# Altium schematic sheet fat41p.SchDoc
size A4
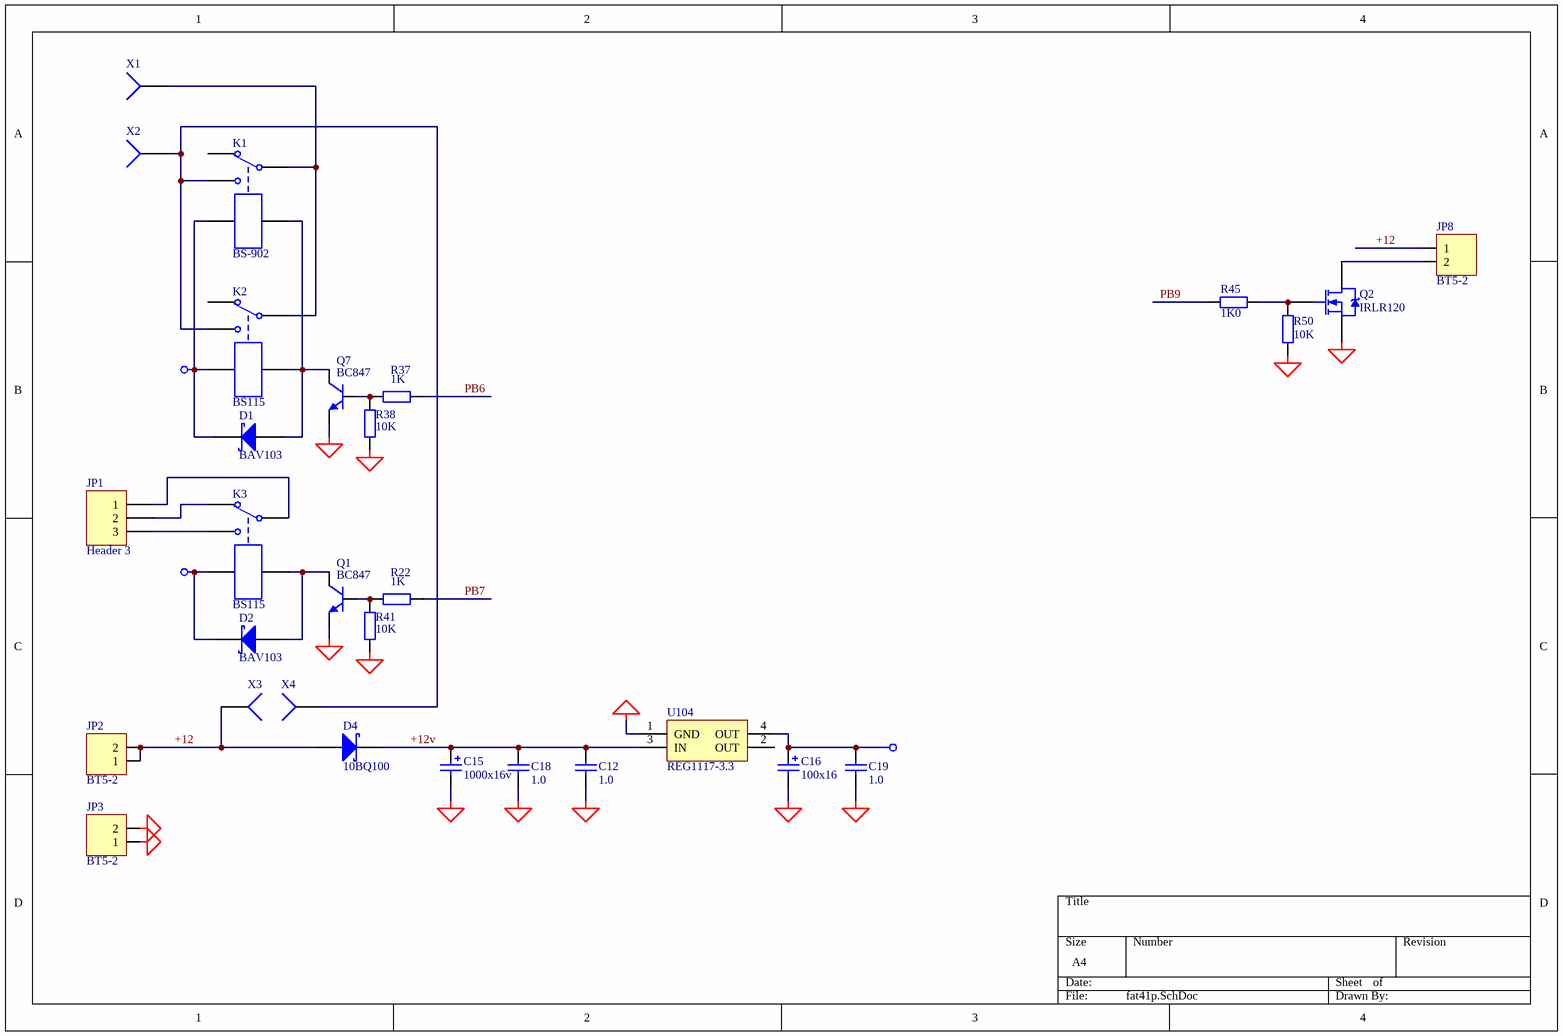
[diagram p0: fat41p.SchDoc]

## Parts
C12  value 1.0  [_1206]  (hidden comment: Cap)
C15  value 1000x16v  [el5]
C16  value 100x16  [el3]
C18  value 1.0  [_1206]  (hidden comment: Cap)
C19  value 1.0  [_1206]  (hidden comment: Cap)
D1  BAV103  [_1206d]
D2  BAV103  [_1206d]
D4  10BQ100  [DSO-C2/X2.3]
JP1  Header 3  [BT5-3]
JP2  BT5-2  [BT5-2-1]
JP3  BT5-2  [BT5-2-1]
JP8  BT5-2  [BT5-2-1]
K1  BS-902  [BS-902]
K2  BS115  [BS115]
K3  BS115  [BS115]
Q1  BC847  [SO-G3]
Q2  IRLR120  [SIP-G3/E8]
Q7  BC847  [SO-G3]
R22  value 1K  [_1206]  (hidden comment: Res2)
R37  value 1K  [_1206]  (hidden comment: Res2)
R38  value 10K  [_1206]  (hidden comment: Res2)
R41  value 10K  [_1206]  (hidden comment: Res2)
R45  1K0  [_1206]
R50  10K  [_1206]
U104  REG1117-3.3  [SIP-G3/C7.4]
X1  (no value)  [PIN3]
X2  (no value)  [PIN3]
X3  (no value)  [PIN1]
X4  (no value)  [PIN1]

## Nets
+3v3: C16.1 C19.2 U104.4(OUT)
+12v: C12.2 C15.1 C18.2 D1.2(K) D2.2(K) D4.2(K) K1.5 K2.5 K3.5 U104.3(IN)
GND: C12.1 C15.2 C16.2 C18.1 C19.1 JP3.1 JP3.2 Q1.2(E) Q2.3(S) Q7.2(E) R38.2 R41.2 R50.2 U104.1(GND)
+12: D4.1(A) JP2.1 JP2.2 JP8.1 X3.1
PB6: R37.2
PB7: R22.2
PB9: R45.1
NetD1_1: D1.1(A) K1.4 K2.4 Q7.3(C)
NetD2_1: D2.1(A) K3.4 Q1.3(C)
NetJP1_1: JP1.1 K3.1
NetJP1_2: JP1.2 K3.2
NetJP1_3: JP1.3 K3.3
NetJP8_2: JP8.2 Q2.4(D)
NetK1_1: K1.1 K2.1 X1.1
NetK1_3: K1.3 K2.3 X2.1 X4.1
NetQ1_1: Q1.1(B) R22.1 R41.1
NetQ2_1: Q2.1(G) R45.2 R50.1
NetQ7_1: Q7.1(B) R37.1 R38.1

Not connected (* = marked no-connect by the designer): K1 2; K2 2; U104 2(OUT)

## Library data of the parts
C12 C18 C19 = Cap: Capacitor; Manufacturer: Generic Components; Class I: Passive; Published: 8-Jun-2000; Revision: July-2002: Re-released for DXP Platform.; Publisher: Altium Limited; Class II: Capacitor
C15 = Cap Pol1: Polarized Capacitor (Radial); Manufacturer: Generic Components; Class I: Passive; Published: 8-Jun-2000; Revision: July-2002: Re-released for DXP Platform.; Publisher: Altium Limited; Class II: Capacitor
C16 = Cap Pol: Polarized Capacitor (Radial); Manufacturer: Generic Components; Class I: Passive; Published: 8-Jun-2000; Revision: July-2002: Re-released for DXP Platform.; Publisher: Altium Limited; Class II: Capacitor
D1 D2 D4 = 10BQ015: Schottky Rectifier; Manufacturer: International Rectifier; Revision 1: 10-July-2000: SIM Model Added.; Revision 2: July-2002: Re-released for DXP Platform.; Class I: Discrete; Class II: Rectifier - Schottky; Published: 8-Jun-2000; Datasheet: Latest Revision: PD-2.396A; Package Reference: DO-214AA; Publisher: Altium Limited
JP1 = Header 3: Header, 3-Pin; Manufacturer: Generic Components; Class I: Connector; Revision: July-2002: Re-released for DXP Platform.; Publisher: Altium Limited
JP2 JP3 JP8 = BT5-2: Header, 3-Pin; Manufacturer: Generic Components; Class I: Connector; Revision: July-2002: Re-released for DXP Platform.; Publisher: Altium Limited
K1-K3 = BS115: Single-Pole Dual-Throw Relay; Manufacturer: Generic Components; Class I: Electro-mechanical; Published: 24-Mar-1999; Revision: July-2002: Re-released for DXP Platform.; Publisher: Altium Limited; Class II: Relay
Q1 Q7 = BC847ALT1: General Purpose Transistor NPN Silicon; Manufacturer: Motorola; Package Information: Latest Revision: 1997; Class I: Discrete; Class II: BJT - Low Power; Published: 29-Sep-2000; Revision: July-2002: Re-released for DXP Platform.; Datasheet: Latest Revision: 1997; Package Reference: 318-08; Publisher: Altium Limited
Q2 = IRFR120: HEXFET N-Channel Power MOSFET; Manufacturer: International Rectifier; Revision 1: 10-July-2000: SIM Model Added.; Revision 2: July-2002: Re-released for DXP Platform.; Class I: Discrete; Class II: MOSFET - Power; Note: Pin 2 is trimmed and is electrically connected to Drain.; Published: 8-Jun-2000; Datasheet: Latest Revision: PD-9.523D; Package Reference: TO-252AA; Publisher: Altium Limited
R22 R37 R38 R41 = Res2: Resistor; Manufacturer: Generic Components; Class I: Passive; Published: 8-Jun-2000; Revision: July-2002: Re-released for DXP Platform.; Publisher: Altium Limited; Class II: Resistor
R45 R50 = Res2: Resistor; Manufacturer: Generic Components; Class I: Passive; Value: 1K; Published: 8-Jun-2000; Revision: July-2002: Re-released for DXP Platform.; Publisher: Altium Limited; Class II: Resistor
U104 = REG1117-3.3: 800mA and 1A Low Dropout Positive Regulator 2.85V, 3.3V, 5V, and Adjustable; Manufacturer: Burr-Brown; Package Information: Latest Revision: Rev. C; Class I: Power Management; Class II: Voltage Regulator; Published: 8-Jun-2000; Revision: July-2002: Re-released for DXP Platform.; Datasheet: Latest Revision: Sep-1997; Package Reference: ZZ311; Publisher: Altium Limited
X1-X4 = Socket: Manufacturer: Generic Components; Class I: Connector; Revision: July-2002: Re-released for DXP Platform.; Publisher: Altium Limited